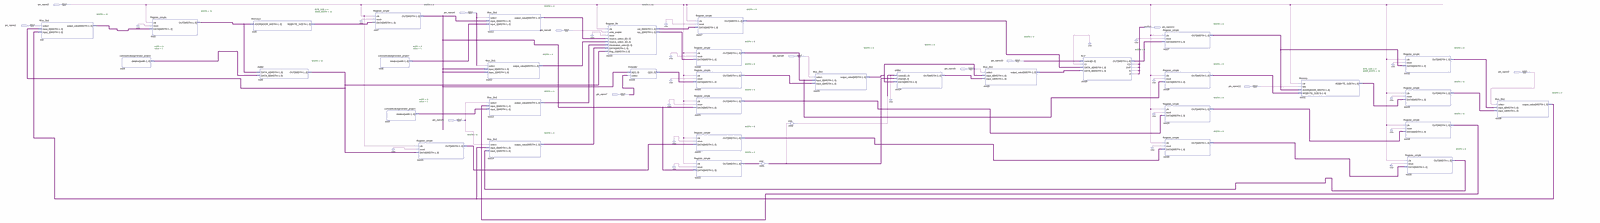
[diagram p0: schematic sheet, whole]
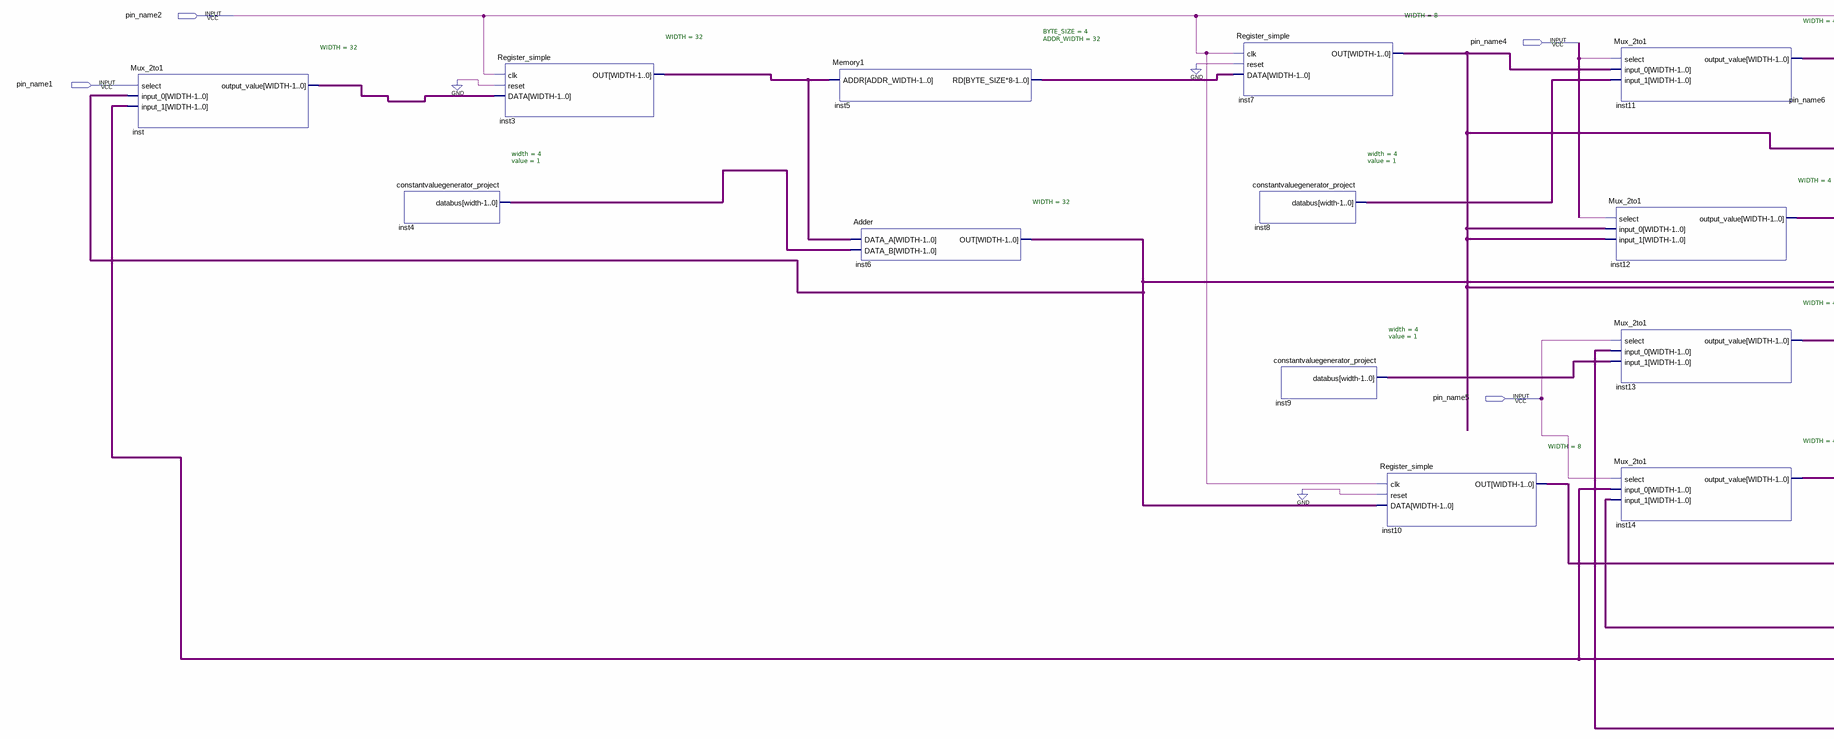
[diagram p1: schematic sheet, left part]
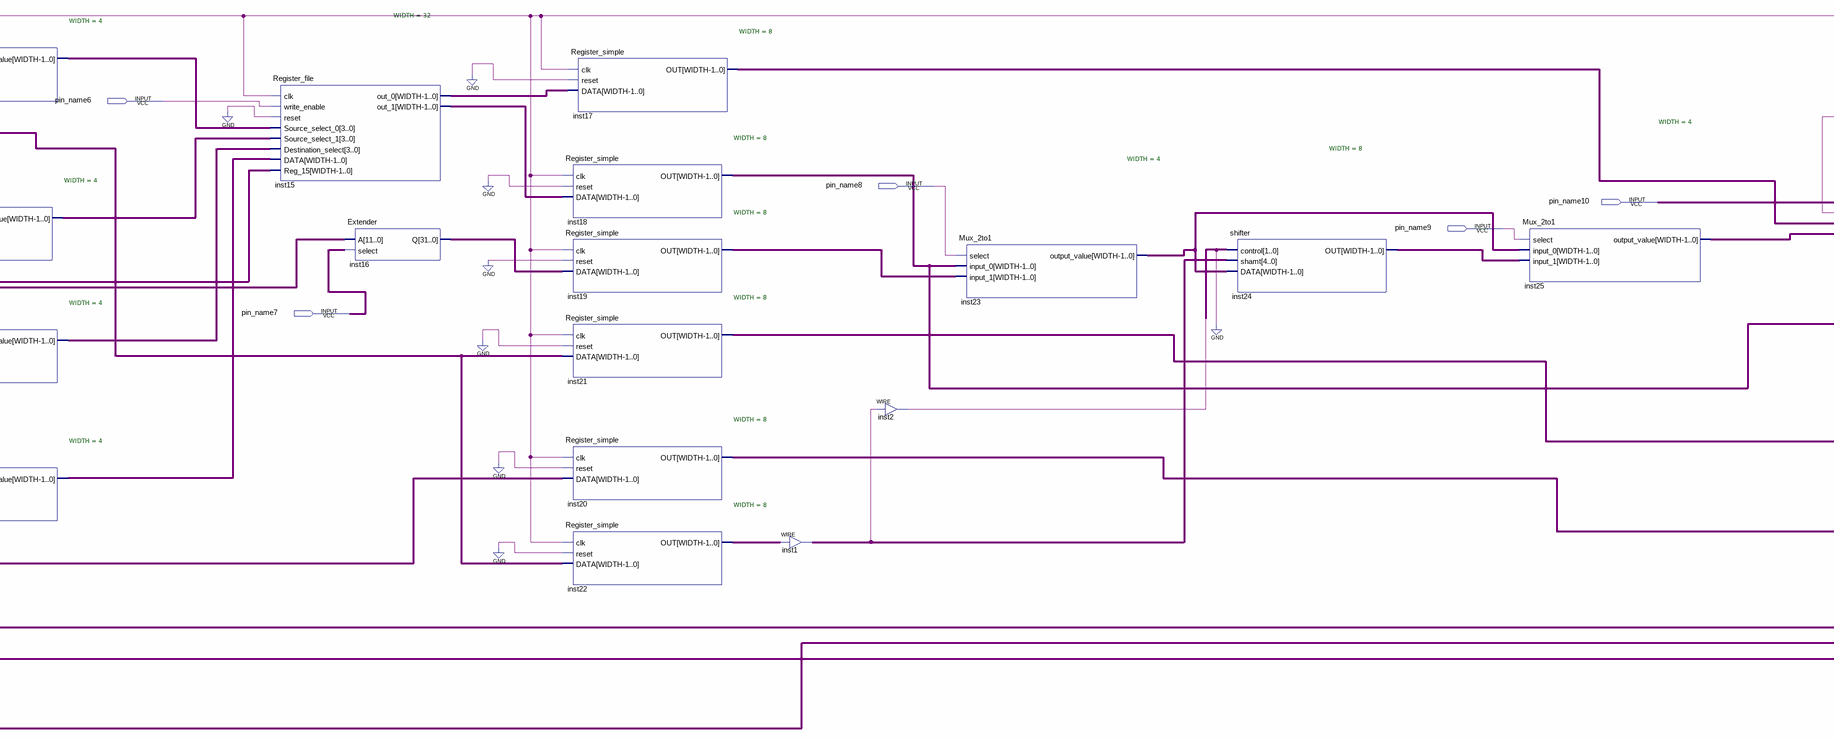
[diagram p2: schematic sheet, centre part]
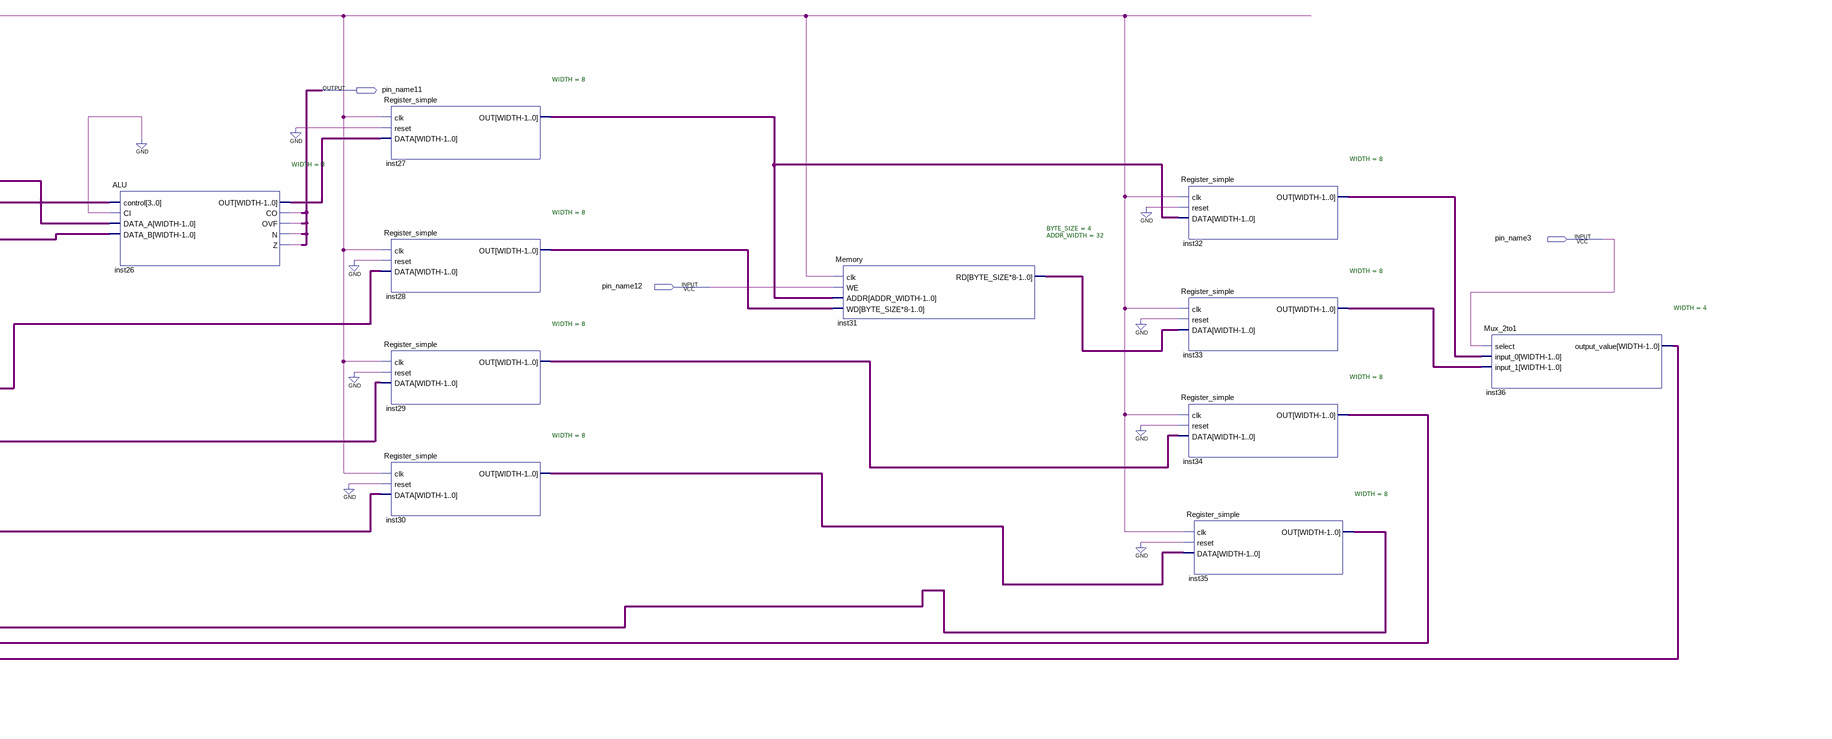
[diagram p3: schematic sheet, right part]
// Quartus schematic PATHHHHHHH.bdf as structural Verilog: 37 symbols, 12 pins
module PATHHHHHHH (
  input  pin_name2,
  input  pin_name4,
  input  pin_name1,
  input  pin_name6,
  input  pin_name8,
  input  pin_name10,
  input  pin_name9,
  input  pin_name3,
  input  pin_name12,
  input  pin_name7,
  input  pin_name5,
  output pin_name11
);

  wire inst2_out, undriven;
  wire [1:0] undriven_2;
  wire [3:0] inst8_databus, inst9_databus, inst11_output_value, inst12_output_value, inst13_output_value,
       undriven_3;
  wire [7:0] inst1_out, inst10_out, inst17_out, inst18_out, inst19_out, inst20_out, inst21_out, inst22_out,
       inst23_output_value, inst24_out, inst25_output_value, inst26_out, inst29_out, inst30_out, inst32_out,
       inst33_out, inst34_out, inst35_out;
  wire [11:0] inst7_out;
  wire [31:0] inst3_out, inst4_databus, inst5_rd, inst6_out, inst14_output_value, inst15_out_0, inst15_out_1,
       inst16_q, inst27_out, inst28_out, inst31_rd, inst36_output_value, inst_output_value;

  Mux_2to1 #(.WIDTH(32)) inst (
    .select(pin_name1), .input_0(inst6_out), .input_1(inst36_output_value), .output_value(inst_output_value));
  constantvaluegenerator_project #(.width(4), .value(1)) inst4 (.databus(inst4_databus));
  Register_simple #(.WIDTH(32)) inst3 (.clk(pin_name2), .reset(1'b0), .DATA(inst_output_value), .OUT(inst3_out));
  Memory1 #(.BYTE_SIZE(4), .ADDR_WIDTH(32)) inst5 (.ADDR(inst3_out), .RD(inst5_rd));
  Adder #(.WIDTH(32)) inst6 (.DATA_A(inst3_out), .DATA_B(inst4_databus), .OUT(inst6_out));
  Register_simple #(.WIDTH(8)) inst7 (.clk(pin_name2), .reset(1'b0), .DATA(inst5_rd), .OUT(inst7_out));
  constantvaluegenerator_project #(.width(4), .value(1)) inst8 (.databus(inst8_databus));
  constantvaluegenerator_project #(.width(4), .value(1)) inst9 (.databus(inst9_databus));
  Register_simple #(.WIDTH(8)) inst10 (.clk(pin_name2), .reset(1'b0), .DATA(inst6_out), .OUT(inst10_out));
  Mux_2to1 #(.WIDTH(4)) inst11 (
    .select(pin_name4), .input_0(inst7_out), .input_1(inst8_databus), .output_value(inst11_output_value));
  Mux_2to1 #(.WIDTH(4)) inst12 (
    .select(pin_name4), .input_0(inst7_out), .input_1(inst7_out), .output_value(inst12_output_value));
  Mux_2to1 #(.WIDTH(4)) inst13 (
    .select(pin_name5), .input_0(inst34_out), .input_1(inst9_databus), .output_value(inst13_output_value));
  Mux_2to1 #(.WIDTH(4)) inst14 (
    .select(pin_name5), .input_0(inst36_output_value), .input_1(inst35_out),
    .output_value(inst14_output_value));
  Register_file #(.WIDTH(32)) inst15 (
    .clk(pin_name2), .write_enable(pin_name6), .reset(1'b0), .Source_select_0(inst11_output_value),
    .Source_select_1(inst12_output_value), .Destination_select(inst13_output_value),
    .DATA(inst14_output_value), .Reg_15(inst6_out), .out_0(inst15_out_0), .out_1(inst15_out_1));
  Extender inst16 (.A(inst7_out), .select(pin_name7), .Q(inst16_q));
  Register_simple #(.WIDTH(8)) inst17 (.clk(pin_name2), .reset(1'b0), .DATA(inst15_out_0), .OUT(inst17_out));
  Register_simple #(.WIDTH(8)) inst18 (.clk(pin_name2), .reset(1'b0), .DATA(inst15_out_1), .OUT(inst18_out));
  Register_simple #(.WIDTH(8)) inst19 (.clk(pin_name2), .reset(1'b0), .DATA(inst16_q), .OUT(inst19_out));
  Register_simple #(.WIDTH(8)) inst21 (.clk(pin_name2), .reset(1'b0), .DATA(inst7_out), .OUT(inst21_out));
  Register_simple #(.WIDTH(8)) inst20 (.clk(pin_name2), .reset(1'b0), .DATA(inst10_out), .OUT(inst20_out));
  Register_simple #(.WIDTH(8)) inst22 (.clk(pin_name2), .reset(1'b0), .DATA(inst7_out), .OUT(inst22_out));
  assign inst1_out = inst22_out;  // WIRE inst1
  assign inst2_out = undriven;  // WIRE inst2
  Mux_2to1 #(.WIDTH(4)) inst23 (
    .select(pin_name8), .input_0(inst18_out), .input_1(inst19_out), .output_value(inst23_output_value));
  shifter #(.WIDTH(8)) inst24 (.control(undriven_2), .shamt(inst1_out), .DATA(inst23_output_value), .OUT(inst24_out));
  Mux_2to1 #(.WIDTH(4)) inst25 (
    .select(pin_name9), .input_0(inst23_output_value), .input_1(inst24_out),
    .output_value(inst25_output_value));
  ALU #(.WIDTH(8)) inst26 (
    .control(undriven_3), .CI(1'b0), .DATA_A(inst17_out), .DATA_B(inst25_output_value), .OUT(inst26_out),
    .CO(pin_name11), .OVF(pin_name11), .N(pin_name11), .Z(pin_name11));
  Register_simple #(.WIDTH(8)) inst27 (.clk(pin_name2), .reset(1'b0), .DATA(inst26_out), .OUT(inst27_out));
  Register_simple #(.WIDTH(8)) inst28 (.clk(pin_name2), .reset(1'b0), .DATA(inst18_out), .OUT(inst28_out));
  Register_simple #(.WIDTH(8)) inst29 (.clk(pin_name2), .reset(1'b0), .DATA(inst21_out), .OUT(inst29_out));
  Register_simple #(.WIDTH(8)) inst30 (.clk(pin_name2), .reset(1'b0), .DATA(inst20_out), .OUT(inst30_out));
  Memory #(.BYTE_SIZE(4), .ADDR_WIDTH(32)) inst31 (
    .clk(pin_name2), .WE(pin_name12), .ADDR(inst27_out), .WD(inst28_out), .RD(inst31_rd));
  Register_simple #(.WIDTH(8)) inst32 (.clk(pin_name2), .reset(1'b0), .DATA(inst27_out), .OUT(inst32_out));
  Register_simple #(.WIDTH(8)) inst33 (.clk(pin_name2), .reset(1'b0), .DATA(inst31_rd), .OUT(inst33_out));
  Register_simple #(.WIDTH(8)) inst34 (.clk(pin_name2), .reset(1'b0), .DATA(inst29_out), .OUT(inst34_out));
  Register_simple #(.WIDTH(8)) inst35 (.clk(pin_name2), .reset(1'b0), .DATA(inst30_out), .OUT(inst35_out));
  Mux_2to1 #(.WIDTH(4)) inst36 (
    .select(pin_name3), .input_0(inst32_out), .input_1(inst33_out), .output_value(inst36_output_value));
endmodule
